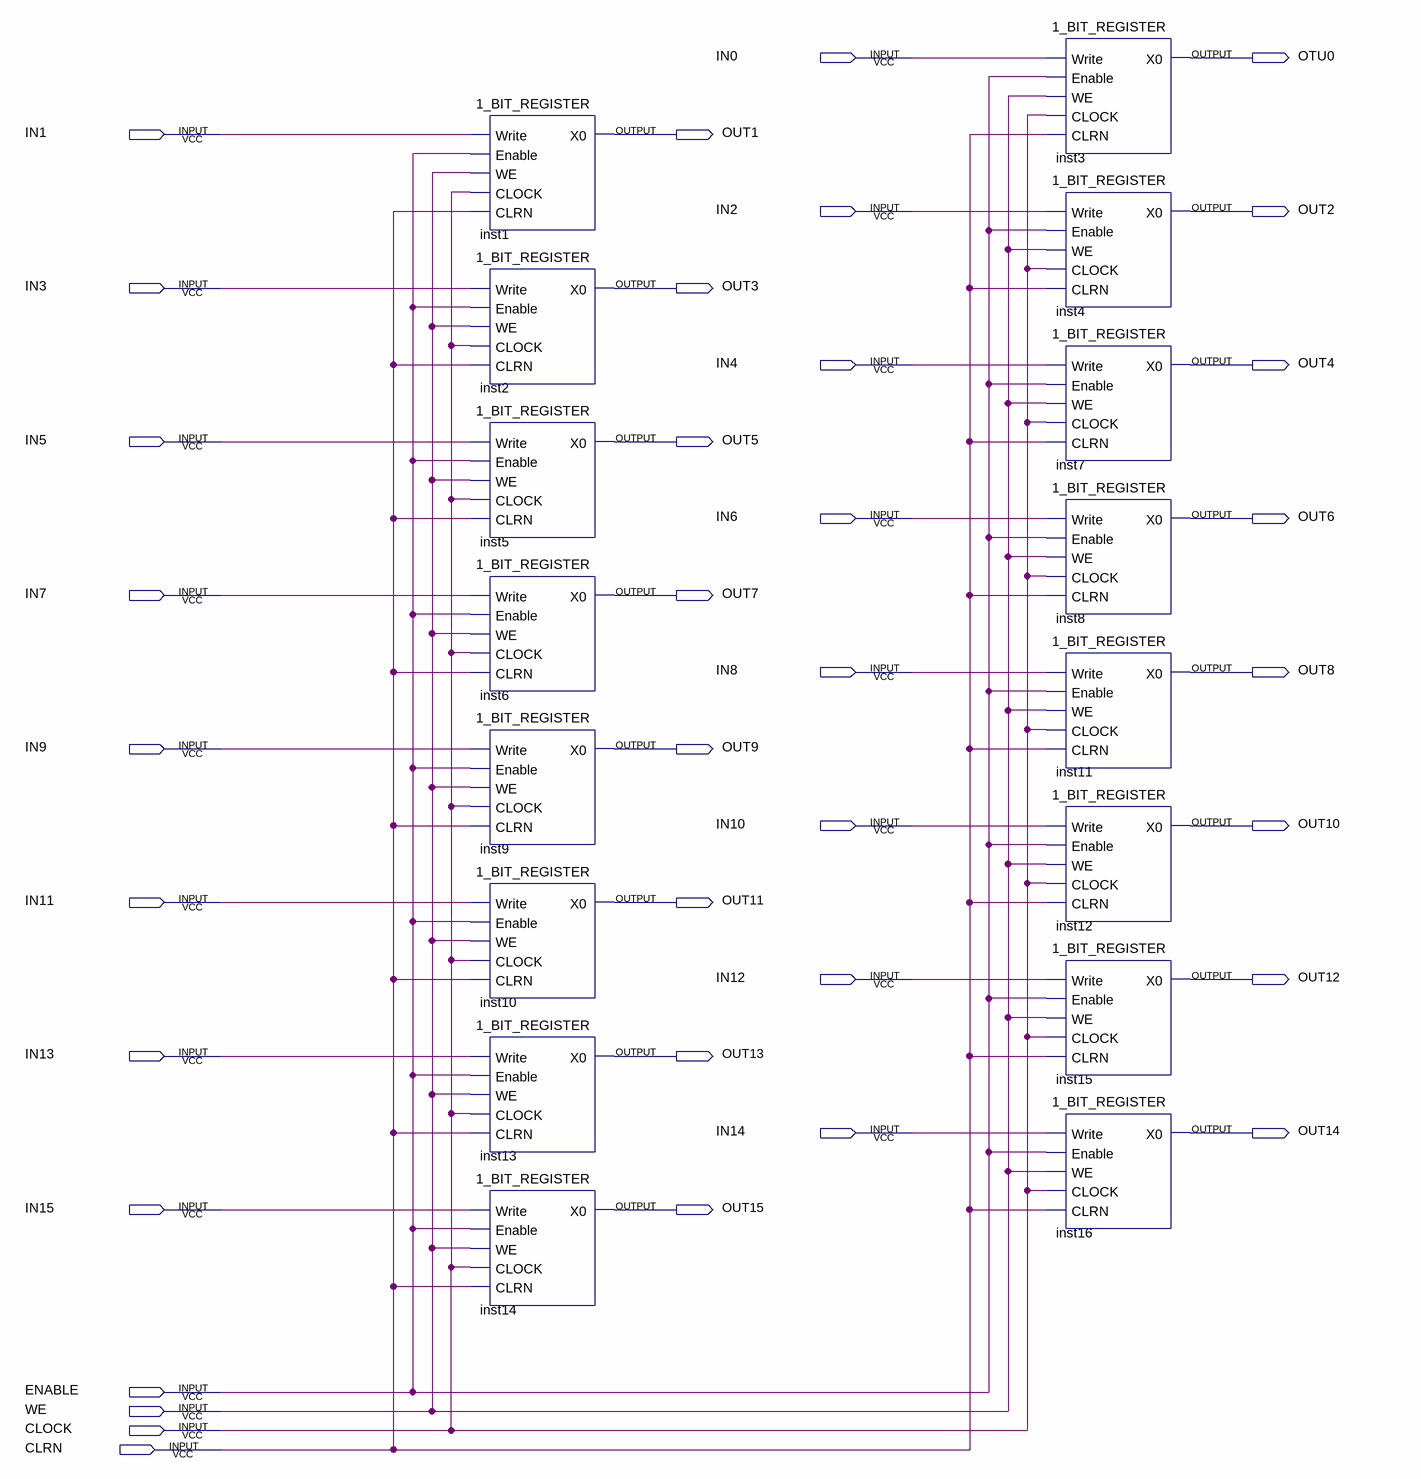
[diagram p0: schematic sheet]
// Quartus schematic 16_B_REG.bdf as structural Verilog: 16 symbols, 36 pins
module \16_B_REG  (
  input  IN0,
  input  IN1,
  input  IN2,
  input  IN3,
  input  IN4,
  input  IN5,
  input  IN6,
  input  IN7,
  input  IN8,
  input  IN9,
  input  IN10,
  input  IN11,
  input  IN12,
  input  IN13,
  input  IN14,
  input  IN15,
  input  ENABLE,
  input  WE,
  input  CLOCK,
  input  CLRN,
  output OTU0,
  output OUT1,
  output OUT2,
  output OUT3,
  output OUT4,
  output OUT5,
  output OUT6,
  output OUT7,
  output OUT8,
  output OUT9,
  output OUT10,
  output OUT11,
  output OUT12,
  output OUT13,
  output OUT14,
  output OUT15
);

  \1_BIT_REGISTER  inst1 (.Write(IN1), .Enable(ENABLE), .WE(WE), .CLOCK(CLOCK), .CLRN(CLRN), .X0(OUT1));
  \1_BIT_REGISTER  inst2 (.Write(IN3), .Enable(ENABLE), .WE(WE), .CLOCK(CLOCK), .CLRN(CLRN), .X0(OUT3));
  \1_BIT_REGISTER  inst5 (.Write(IN5), .Enable(ENABLE), .WE(WE), .CLOCK(CLOCK), .CLRN(CLRN), .X0(OUT5));
  \1_BIT_REGISTER  inst6 (.Write(IN7), .Enable(ENABLE), .WE(WE), .CLOCK(CLOCK), .CLRN(CLRN), .X0(OUT7));
  \1_BIT_REGISTER  inst9 (.Write(IN9), .Enable(ENABLE), .WE(WE), .CLOCK(CLOCK), .CLRN(CLRN), .X0(OUT9));
  \1_BIT_REGISTER  inst10 (.Write(IN11), .Enable(ENABLE), .WE(WE), .CLOCK(CLOCK), .CLRN(CLRN), .X0(OUT11));
  \1_BIT_REGISTER  inst13 (.Write(IN13), .Enable(ENABLE), .WE(WE), .CLOCK(CLOCK), .CLRN(CLRN), .X0(OUT13));
  \1_BIT_REGISTER  inst14 (.Write(IN15), .Enable(ENABLE), .WE(WE), .CLOCK(CLOCK), .CLRN(CLRN), .X0(OUT15));
  \1_BIT_REGISTER  inst3 (.Write(IN0), .Enable(ENABLE), .WE(WE), .CLOCK(CLOCK), .CLRN(CLRN), .X0(OTU0));
  \1_BIT_REGISTER  inst4 (.Write(IN2), .Enable(ENABLE), .WE(WE), .CLOCK(CLOCK), .CLRN(CLRN), .X0(OUT2));
  \1_BIT_REGISTER  inst7 (.Write(IN4), .Enable(ENABLE), .WE(WE), .CLOCK(CLOCK), .CLRN(CLRN), .X0(OUT4));
  \1_BIT_REGISTER  inst8 (.Write(IN6), .Enable(ENABLE), .WE(WE), .CLOCK(CLOCK), .CLRN(CLRN), .X0(OUT6));
  \1_BIT_REGISTER  inst11 (.Write(IN8), .Enable(ENABLE), .WE(WE), .CLOCK(CLOCK), .CLRN(CLRN), .X0(OUT8));
  \1_BIT_REGISTER  inst12 (.Write(IN10), .Enable(ENABLE), .WE(WE), .CLOCK(CLOCK), .CLRN(CLRN), .X0(OUT10));
  \1_BIT_REGISTER  inst15 (.Write(IN12), .Enable(ENABLE), .WE(WE), .CLOCK(CLOCK), .CLRN(CLRN), .X0(OUT12));
  \1_BIT_REGISTER  inst16 (.Write(IN14), .Enable(ENABLE), .WE(WE), .CLOCK(CLOCK), .CLRN(CLRN), .X0(OUT14));
endmodule
